# Altium schematic sheet S7CAS-PLEIADES-CARTE-MERE_P07_ADC.SchDoc
size Tabloid; DocumentNumber: 15; SheetNumber: 15; SheetTotal: 16; Sheet_Name: ADC; Size: 11x17
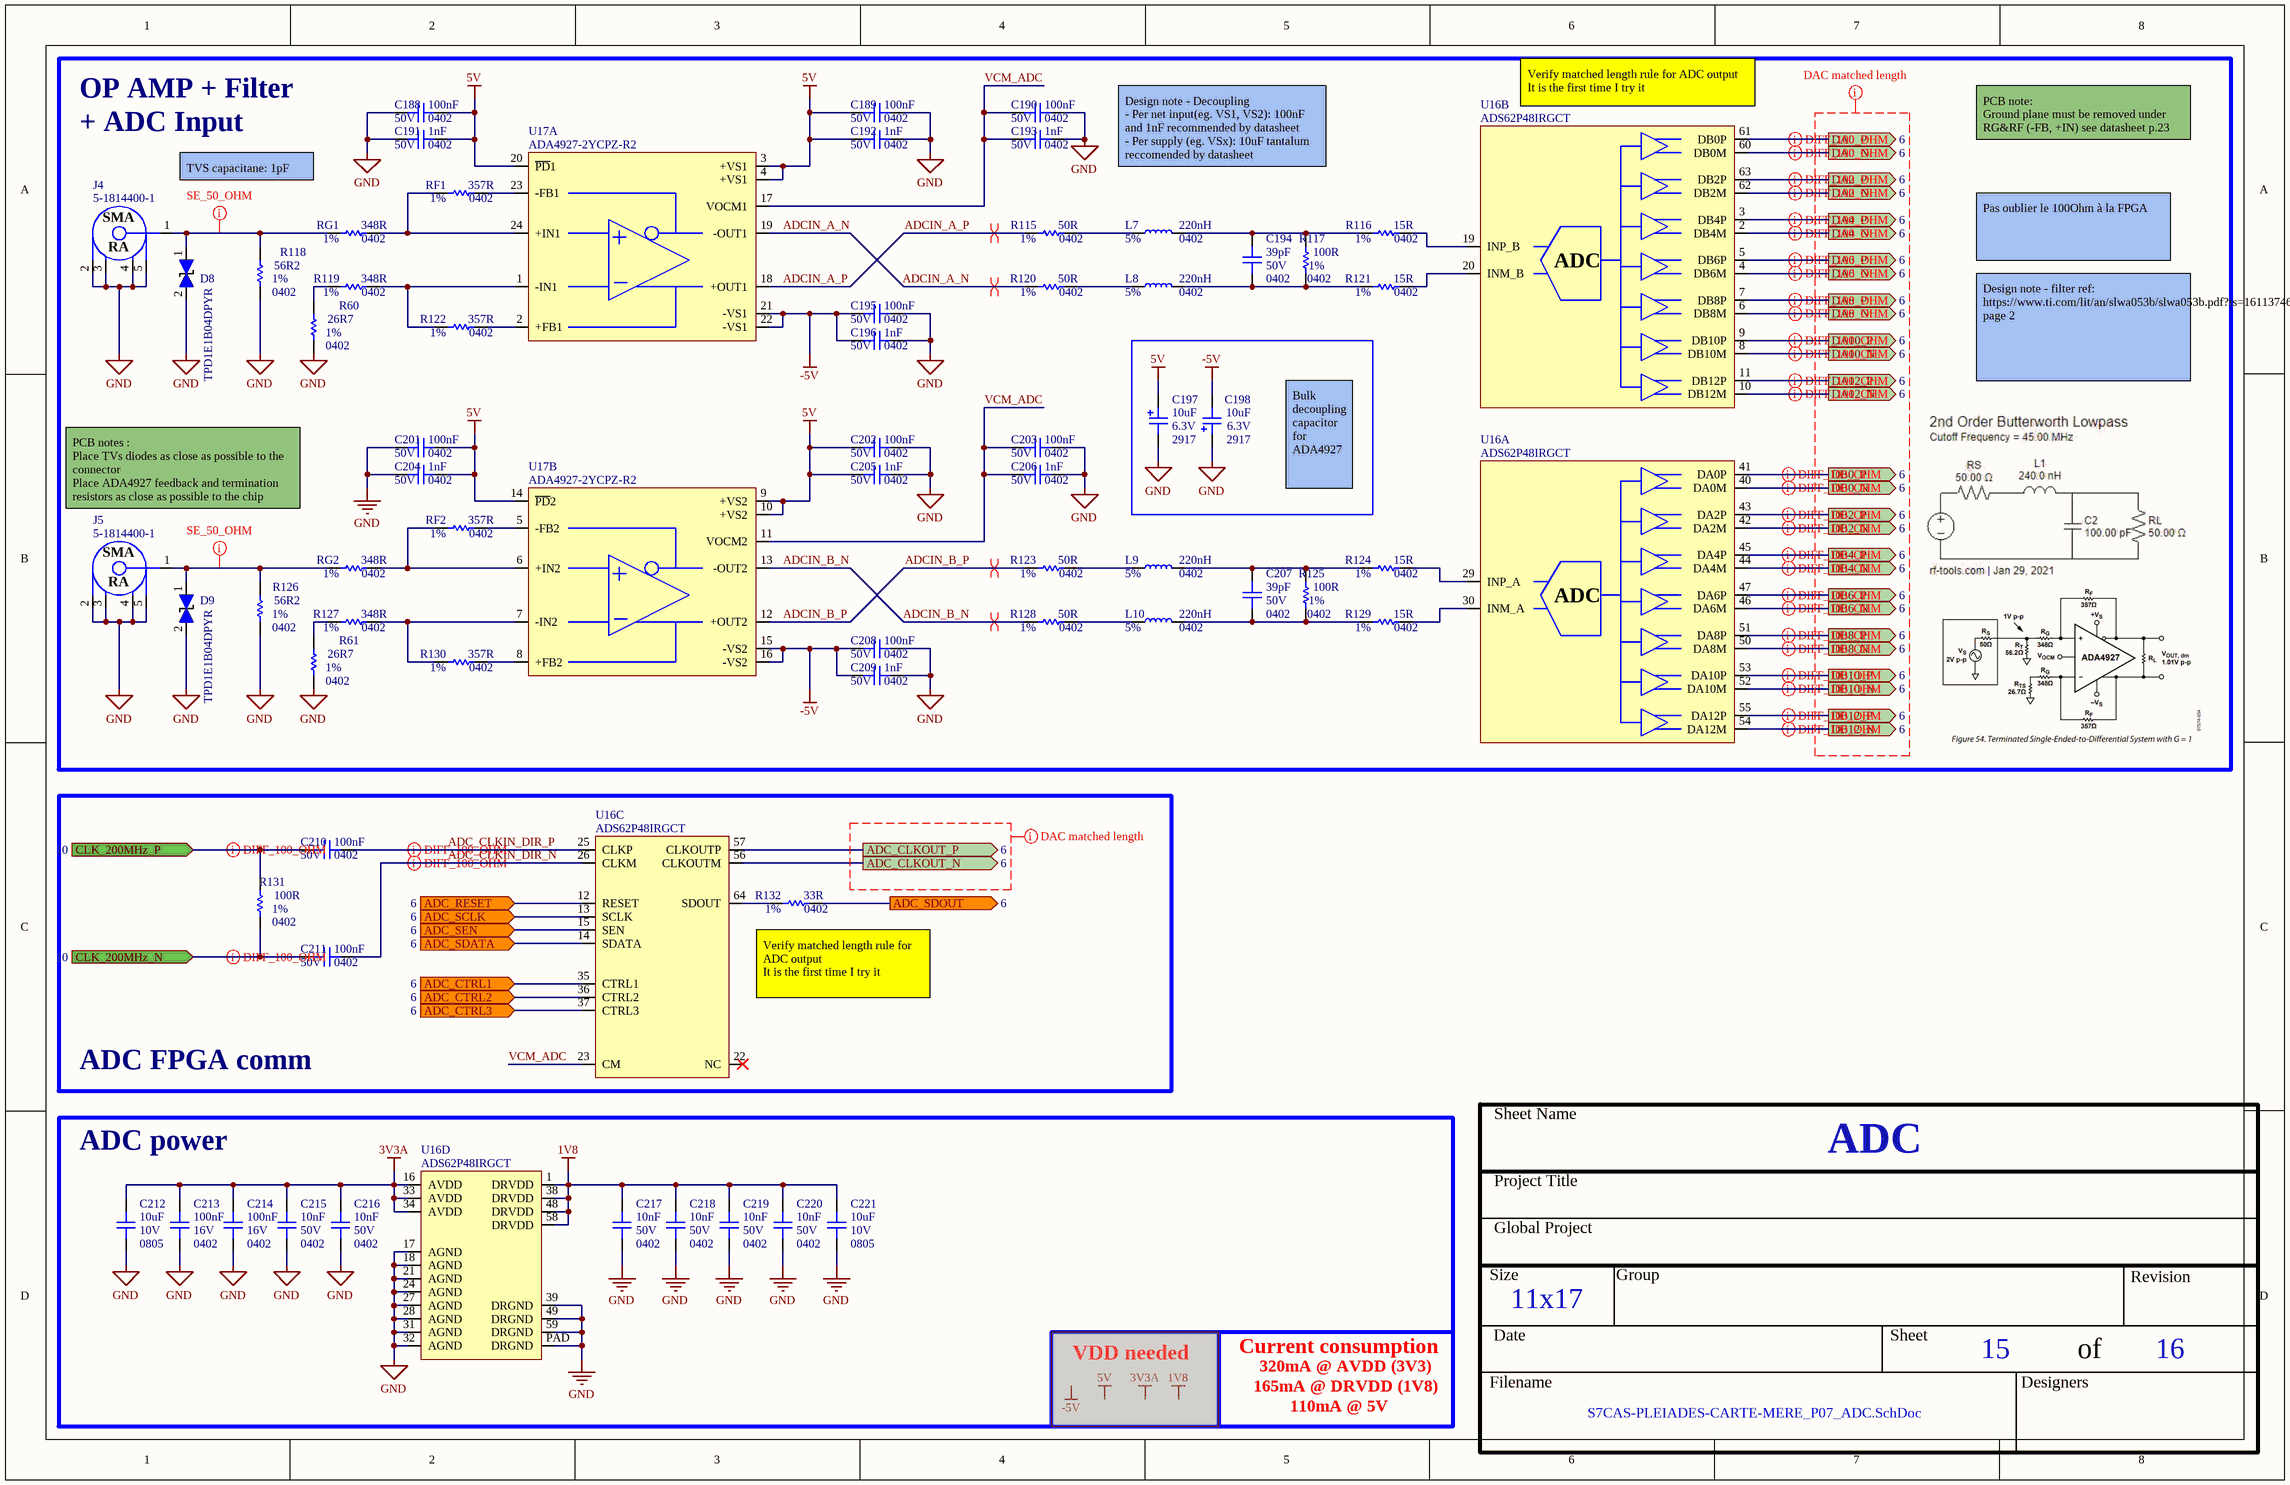
[diagram p0: S7CAS-PLEIADES-CARTE-MERE_P07_ADC.SchDoc]

## Parts
C188  value 100nF  Voltage: 50V  Package: 0402  [CAP_0402]  (hidden comment: CAP - 0402)
C189  value 100nF  Voltage: 50V  Package: 0402  [CAP_0402]  (hidden comment: CAP - 0402)
C190  value 100nF  Voltage: 50V  Package: 0402  [CAP_0402]  (hidden comment: CAP - 0402)
C191  value 1nF  Voltage: 50V  Package: 0402  [CAP_0402]  (hidden comment: CAP - 0402)
C192  value 1nF  Voltage: 50V  Package: 0402  [CAP_0402]  (hidden comment: CAP - 0402)
C193  value 1nF  Voltage: 50V  Package: 0402  [CAP_0402]  (hidden comment: CAP - 0402)
C194  value 39pF  Voltage: 50V  Package: 0402  [CAP_0402]  (hidden comment: CAP - 0402)
C195  value 100nF  Voltage: 50V  Package: 0402  [CAP_0402]  (hidden comment: CAP - 0402)
C196  value 1nF  Voltage: 50V  Package: 0402  [CAP_0402]  (hidden comment: CAP - 0402)
C197  value 10uF  Voltage: 6.3V  Package: 2917  [CAP_TAN_2917(D)]  (hidden comment: CAP - TANTALUM - CASE D)
C198  value 10uF  Voltage: 6.3V  Package: 2917  [CAP_TAN_2917(D)]  (hidden comment: CAP - TANTALUM - CASE D)
C201  value 100nF  Voltage: 50V  Package: 0402  [CAP_0402]  (hidden comment: CAP - 0402)
C202  value 100nF  Voltage: 50V  Package: 0402  [CAP_0402]  (hidden comment: CAP - 0402)
C203  value 100nF  Voltage: 50V  Package: 0402  [CAP_0402]  (hidden comment: CAP - 0402)
C204  value 1nF  Voltage: 50V  Package: 0402  [CAP_0402]  (hidden comment: CAP - 0402)
C205  value 1nF  Voltage: 50V  Package: 0402  [CAP_0402]  (hidden comment: CAP - 0402)
C206  value 1nF  Voltage: 50V  Package: 0402  [CAP_0402]  (hidden comment: CAP - 0402)
C207  value 39pF  Voltage: 50V  Package: 0402  [CAP_0402]  (hidden comment: CAP - 0402)
C208  value 100nF  Voltage: 50V  Package: 0402  [CAP_0402]  (hidden comment: CAP - 0402)
C209  value 1nF  Voltage: 50V  Package: 0402  [CAP_0402]  (hidden comment: CAP - 0402)
C210  value 100nF  Voltage: 50V  Package: 0402  [CAP_0402]  (hidden comment: CAP - 0402)
C211  value 100nF  Voltage: 50V  Package: 0402  [CAP_0402]  (hidden comment: CAP - 0402)
C212  value 10uF  Voltage: 10V  Package: 0805  [CAP_0805]  (hidden comment: CAP - 0805)
C213  value 100nF  Voltage: 16V  Package: 0402  [CAP_0402]  (hidden comment: CAP - 0402)
C214  value 100nF  Voltage: 16V  Package: 0402  [CAP_0402]  (hidden comment: CAP - 0402)
C215  value 10nF  Voltage: 50V  Package: 0402  [CAP_0402]  (hidden comment: CAP - 0402)
C216  value 10nF  Voltage: 50V  Package: 0402  [CAP_0402]  (hidden comment: CAP - 0402)
C217  value 10nF  Voltage: 50V  Package: 0402  [CAP_0402]  (hidden comment: CAP - 0402)
C218  value 10nF  Voltage: 50V  Package: 0402  [CAP_0402]  (hidden comment: CAP - 0402)
C219  value 10nF  Voltage: 50V  Package: 0402  [CAP_0402]  (hidden comment: CAP - 0402)
C220  value 10nF  Voltage: 50V  Package: 0402  [CAP_0402]  (hidden comment: CAP - 0402)
C221  value 10uF  Voltage: 10V  Package: 0805  [CAP_0805]  (hidden comment: CAP - 0805)
D8  TPD1E1B04DPYR  [TVS_DATA_TPD1E1B04DPYR]
D9  TPD1E1B04DPYR  [TVS_DATA_TPD1E1B04DPYR]
J4  5-1814400-1  [CONN_SMA_5-1814400-1]
J5  5-1814400-1  [CONN_SMA_5-1814400-1]
L7  value 220nH  Precision: 5%  Package: 0402  [IND_0402]  (hidden comment: IND_0402)
L8  value 220nH  Precision: 5%  Package: 0402  [IND_0402]  (hidden comment: IND_0402)
L9  value 220nH  Precision: 5%  Package: 0402  [IND_0402]  (hidden comment: IND_0402)
L10  value 220nH  Precision: 5%  Package: 0402  [IND_0402]  (hidden comment: IND_0402)
R60  value 26R7  Package: 0402  Precision: 1%  [RES_0402]  (hidden comment: RES - 0402)
R61  value 26R7  Package: 0402  Precision: 1%  [RES_0402]  (hidden comment: RES - 0402)
R115  value 50R  Package: 0402  Precision: 1%  [RES_0402]  (hidden comment: RES - 0402)
R116  value 15R  Package: 0402  Precision: 1%  [RES_0402]  (hidden comment: RES - 0402)
R117  value 100R  Package: 0402  Precision: 1%  [RES_0402]  (hidden comment: RES - 0402)
R118  value 56R2  Package: 0402  Precision: 1%  [RES_0402]  (hidden comment: RES - 0402)
R119  value 348R  Package: 0402  Precision: 1%  [RES_0402]  (hidden comment: RES - 0402)
R120  value 50R  Package: 0402  Precision: 1%  [RES_0402]  (hidden comment: RES - 0402)
R121  value 15R  Package: 0402  Precision: 1%  [RES_0402]  (hidden comment: RES - 0402)
R122  value 357R  Package: 0402  Precision: 1%  [RES_0402]  (hidden comment: RES - 0402)
R123  value 50R  Package: 0402  Precision: 1%  [RES_0402]  (hidden comment: RES - 0402)
R124  value 15R  Package: 0402  Precision: 1%  [RES_0402]  (hidden comment: RES - 0402)
R125  value 100R  Package: 0402  Precision: 1%  [RES_0402]  (hidden comment: RES - 0402)
R126  value 56R2  Package: 0402  Precision: 1%  [RES_0402]  (hidden comment: RES - 0402)
R127  value 348R  Package: 0402  Precision: 1%  [RES_0402]  (hidden comment: RES - 0402)
R128  value 50R  Package: 0402  Precision: 1%  [RES_0402]  (hidden comment: RES - 0402)
R129  value 15R  Package: 0402  Precision: 1%  [RES_0402]  (hidden comment: RES - 0402)
R130  value 357R  Package: 0402  Precision: 1%  [RES_0402]  (hidden comment: RES - 0402)
R131  value 100R  Package: 0402  Precision: 1%  [RES_0402]  (hidden comment: RES - 0402)
R132  value 33R  Package: 0402  Precision: 1%  [RES_0402]  (hidden comment: RES - 0402)
RF1  value 357R  Package: 0402  Precision: 1%  [RES_0402]  (hidden comment: RES - 0402)
RF2  value 357R  Package: 0402  Precision: 1%  [RES_0402]  (hidden comment: RES - 0402)
RG1  value 348R  Package: 0402  Precision: 1%  [RES_0402]  (hidden comment: RES - 0402)
RG2  value 348R  Package: 0402  Precision: 1%  [RES_0402]  (hidden comment: RES - 0402)
U16  ADS62P48IRGCT  [ADC_ADS62P48IRGCT]  (parts A,B,C,D of 4)
U17  ADA4927-2YCPZ-R2  [OPAMP_ADA4927-2YCPZ-R2]  (parts A,B of 2)

## Blocks framed on the sheet
ADC FPGA comm: C210 C211 R131 R132 U16
ADC power: C212-C221 U16

## Ports
ADC_CLKOUT_N (out, see 6), ADC_CLKOUT_P (out, see 6), ADC_CTRL1 (in, see 6), ADC_CTRL2 (in, see 6), ADC_CTRL3 (in, see 6), ADC_RESET (in, see 6), ADC_SCLK (in, see 6), ADC_SDATA (in, see 6), ADC_SDOUT (out, see 6), ADC_SEN (in, see 6), CLK_200MHz_N (in, see 10), CLK_200MHz_P (in, see 10), DA0_N (out, see 6), DA0_P (out, see 6), DA2_N (out, see 6), DA2_P (out, see 6), DA4_N (out, see 6), DA4_P (out, see 6), DA6_N (out, see 6), DA6_P (out, see 6), DA8_N (out, see 6), DA8_P (out, see 6), DA10_N (out, see 6), DA10_P (out, see 6), DA12_N (out, see 6), DA12_P (out, see 6), DB0_N (out, see 6), DB0_P (out, see 6), DB2_N (out, see 6), DB2_P (out, see 6), DB4_N (out, see 6), DB4_P (out, see 6), DB6_N (out, see 6), DB6_P (out, see 6), DB8_N (out, see 6), DB8_P (out, see 6), DB10_N (out, see 6), DB10_P (out, see 6), DB12_N (out, see 6), DB12_P (out, see 6)

## Nets
1V8: C217.2 C218.2 C219.2 C220.2 C221.2 U16.1(DRVDD) U16.38(DRVDD) U16.48(DRVDD) U16.58(DRVDD)
3V3A: C212.2 C213.2 C214.2 C215.2 C216.2 U16.16(AVDD) U16.33(AVDD) U16.34(AVDD)
5V: C188.1 C189.2 C191.1 C192.2 C197.1 C201.1 C202.2 C204.1 C205.2 U17.3(+VS1) U17.4(+VS1) U17.9(+VS2) U17.10(+VS2) U17.14(~{PD}2) U17.20(~{PD}1)
-5V: C195.2 C196.2 C198.2 C208.2 C209.2 U17.15(-VS2) U17.16(-VS2) U17.21(-VS1) U17.22(-VS1)
GND: C188.2 C189.1 C190.1 C191.2 C192.1 C193.1 C195.1 C196.1 C197.2 C198.1 C201.2 C202.1 C203.1 C204.2 C205.1 C206.1 C208.1 C209.1 C212.1 C213.1 C214.1 C215.1 C216.1 C217.1 C218.1 C219.1 C220.1 C221.1 D8.2(i/o) D9.2(i/o) J4.2 J4.3 J4.4 J4.5 J5.2 J5.3 J5.4 J5.5 R60.1 R61.1 R118.1 R126.1 U16.17(AGND) U16.18(AGND) U16.21(AGND) U16.24(AGND) U16.27(AGND) U16.28(AGND) U16.31(AGND) U16.32(AGND) U16.39(DRGND) U16.49(DRGND) U16.59(DRGND) U16.PAD(DRGND)
ADC_CLKIN_DIR_N: C211.1 U16.26(CLKM)
ADC_CLKIN_DIR_P: C210.1 U16.25(CLKP)
ADC_CLKOUT_N: U16.56(CLKOUTM) ; port ADC_CLKOUT_N
ADC_CLKOUT_P: U16.57(CLKOUTP) ; port ADC_CLKOUT_P
ADC_CTRL1: U16.35(CTRL1) ; port ADC_CTRL1
ADC_CTRL2: U16.36(CTRL2) ; port ADC_CTRL2
ADC_CTRL3: U16.37(CTRL3) ; port ADC_CTRL3
ADC_RESET: U16.12(RESET) ; port ADC_RESET
ADC_SCLK: U16.13(SCLK) ; port ADC_SCLK
ADC_SDATA: U16.14(SDATA) ; port ADC_SDATA
ADC_SDOUT: R132.1 ; port ADC_SDOUT
ADC_SEN: U16.15(SEN) ; port ADC_SEN
ADCIN_A_N: R120.2 U17.19(-OUT1)
ADCIN_A_P: R115.2 U17.18(+OUT1)
ADCIN_B_N: R128.2 U17.13(-OUT2)
ADCIN_B_P: R123.2 U17.12(+OUT2)
CLK_200MHz_N: C211.2 R131.1 ; port CLK_200MHz_N
CLK_200MHz_P: C210.2 R131.2 ; port CLK_200MHz_P
DA0_N: U16.60(DB0M) ; port DA0_N
DA0_P: U16.61(DB0P) ; port DA0_P
DA2_N: U16.62(DB2M) ; port DA2_N
DA2_P: U16.63(DB2P) ; port DA2_P
DA4_N: U16.2(DB4M) ; port DA4_N
DA4_P: U16.3(DB4P) ; port DA4_P
DA6_N: U16.4(DB6M) ; port DA6_N
DA6_P: U16.5(DB6P) ; port DA6_P
DA8_N: U16.6(DB8M) ; port DA8_N
DA8_P: U16.7(DB8P) ; port DA8_P
DA10_N: U16.8(DB10M) ; port DA10_N
DA10_P: U16.9(DB10P) ; port DA10_P
DA12_N: U16.10(DB12M) ; port DA12_N
DA12_P: U16.11(DB12P) ; port DA12_P
DB0_N: U16.40(DA0M) ; port DB0_N
DB0_P: U16.41(DA0P) ; port DB0_P
DB2_N: U16.42(DA2M) ; port DB2_N
DB2_P: U16.43(DA2P) ; port DB2_P
DB4_N: U16.44(DA4M) ; port DB4_N
DB4_P: U16.45(DA4P) ; port DB4_P
DB6_N: U16.46(DA6M) ; port DB6_N
DB6_P: U16.47(DA6P) ; port DB6_P
DB8_N: U16.50(DA8M) ; port DB8_N
DB8_P: U16.51(DA8P) ; port DB8_P
DB10_N: U16.52(DA10M) ; port DB10_N
DB10_P: U16.53(DA10P) ; port DB10_P
DB12_N: U16.54(DA12M) ; port DB12_N
DB12_P: U16.55(DA12P) ; port DB12_P
VCM_ADC: C190.2 C193.2 C203.2 C206.2 U16.23(CM) U17.11(VOCM2) U17.17(VOCM1)
NetC194_1: C194.1 L8.1 R117.1 R121.2
NetC194_2: C194.2 L7.1 R116.2 R117.2
NetC207_1: C207.1 L10.1 R125.1 R129.2
NetC207_2: C207.2 L9.1 R124.2 R125.2
NetD8_1: D8.1(i/o) J4.1 R118.2 RG1.2
NetD9_1: D9.1(i/o) J5.1 R126.2 RG2.2
NetL7_2: L7.2 R115.1
NetL8_2: L8.2 R120.1
NetL9_2: L9.2 R123.1
NetL10_2: L10.2 R128.1
NetR60_2: R60.2 R119.2
NetR61_2: R61.2 R127.2
NetR116_1: R116.1 U16.19(INP_B)
NetR119_1: R119.1 R122.2 U17.1(-IN1)
NetR121_1: R121.1 U16.20(INM_B)
NetR122_1: R122.1 U17.2(+FB1)
NetR124_1: R124.1 U16.29(INP_A)
NetR127_1: R127.1 R130.2 U17.7(-IN2)
NetR129_1: R129.1 U16.30(INM_A)
NetR130_1: R130.1 U17.8(+FB2)
NetR132_2: R132.2 U16.64(SDOUT)
NetRF1_1: RF1.1 U17.23(-FB1)
NetRF1_2: RF1.2 RG1.1 U17.24(+IN1)
NetRF2_1: RF2.1 U17.5(-FB2)
NetRF2_2: RF2.2 RG2.1 U17.6(+IN2)

Not connected (* = marked no-connect by the designer): U16 22(NC)*

## Layout directives
differential pair; net class DIFF_100_OHM: ADC_CLKIN_DIR_N, ADC_CLKIN_DIR_P, CLK_200MHz_N, CLK_200MHz_P
differential pair; differential pair class DIFF_100_OHM: DA0_N, DA0_P, DA2_N, DA2_P, DA4_N, DA4_P, DA6_N, DA6_P, DA8_N, DA8_P, DA10_N, DA10_P, DA12_N, DA12_P, DB0_N, DB0_P, DB2_N, DB2_P, DB4_N, DB4_P, DB6_N, DB6_P, DB8_N, DB8_P, DB10_N, DB10_P, DB12_N, DB12_P
rule Matched Net Lengths [Tolerance = 1mil]; net class DAC_OUT: (no net found under the mark)
mark named SE_50_OHM: NetD8_1, NetD9_1
differential pair: ADCIN_A_N, ADCIN_A_P, ADCIN_B_N, ADCIN_B_P

## Notes on the sheet
- OP AMP + Filter
- + ADC Input
- Design note - Decoupling
  - Per net input(eg. VS1, VS2): 100nF and 1nF recommended by datasheet
  - Per supply (eg. VSx): 10uF tantalum reccomended by datasheet
- (near U16) Verify matched length rule for ADC output
  It is the first time I try it
- PCB note:
  Ground plane must be removed under RG&RF (-FB, +IN) see datasheet p.23
- TVS capacitane: 1pF nom.
- Pas oublier le 100Ohm à la FPGA
- Design note - filter ref:
  https://www.ti.com/lit/an/slwa053b/slwa053b.pdf?ts=1611374664037&ref_url=https%253A%252F%252Fwww.google.com%252F
  page 2
- Bulk decoupling capacitor for ADA4927
- PCB notes :
  Place TVs diodes as close as possible to the connector
  Place ADA4927 feedback and termination resistors as close as possible to the chip
- Verify matched length rule for ADC output
  It is the first time I try it
- VDD needed
- Current consumption
- 320mA @ AVDD (3V3)
- 110mA @ 5V
- 165mA @ DRVDD (1V8)
- Sheet Name
- Project Title
- Global Project
- Size
- Group
- Revision
- Date
- Sheet
- of
- Filename
- Designers
- (in symbol ADC_ADS62P48IRGCT, part A) ADC
- (in symbol ADC_ADS62P48IRGCT, part B) ADC
- (in symbol CONN_SMA_5-1814400-1) SMA; RA

## Library data of the parts
C188-C196 C201-C211 = CAP - 0402: Precision: 10%; Current: *; CreatedBy: Jonathan Bouchard; Power: *
C197 C198 = CAP_TANT_2917(D): CAP - TANTALUM - 2917; Precision: 10%; Current: *; CreatedBy: Jonathan Bouchard; Power: *
C212 C221 = CAP - 0805: Mfg: CL21B106KPQNNNE; Precision: 10%; Current: *; CreatedBy: Jonathan Bouchard; Power: *
C213 C214 = CAP - 0402: Mfg Part Number: CL05B104KO5NNNC; Precision: 10%; Current: *; CreatedBy: Jonathan Bouchard; Power: *
C215-C220 = CAP - 0402: Mfg Part Number: CL05B103KB5NNNC; Precision: 10%; Current: *; CreatedBy: Jonathan Bouchard; Temperature: X7R; Power: *
D8 D9 = TVS_DATA_TPD1E1B04DPYR: TVS - TVS DIODE 3.6V 8.5V - 0402; Manufacturer #1: Texas Instruments; Current Rating: 6.3Apeak; Power Max: 50Wpeak; GRAMS Lib Spec: 2.8; Magnetic Material: Unknown; Polarized: No; Value: *; Tolerance: *; Voltage Rating: 3.6V; HelpURL: http://www.ti.com/lit/ds/symlink/tpd1e1b04.pdf; CreatedBy/Date: Keven Deslandes - 2018/10/19; VerifiedBy: Caroline Paulin - 28 janv 2019; Temperature: -40°C ~ 125°C (TA); Package: 0402; Manufacturer #2: *; Note: *; Assembly Type: SMD; Part Number #2: *; Part Number #1: TPD1E1B04DPYR; Supplier 1: Digi-Key; Supplier Part Number 1: 296-47364-1-ND; Cryo: UNKNOWN
J4 J5 = CONN_SMA_5-1814400-1: CONN -  SMA JACK R/A 50 OHM - TH; Mfg: TE Connectivity AMP Connectors; Voltage: *; Current: *; Power: *; Mfg Part Number: 5-1814400-1; HelpURL: http://www.te.com/commerce/DocumentDelivery/DDEController?Action=srchrtrv&DocNm=1814400&DocType=Customer+Drawing&DocLang=English; CreatedBy: Jonathan Bouchard; Temperature: -55°C ~ 85°C; Value: *; Precision: *; Package: TH-5; Supplier 1: Digikey; Supplier Part Number 1: A97593-ND
R60 R61 R115-R132 RF1 RF2 RG1 RG2 = RES - 0402: Voltage: 50V; Power: 1/16W; Current: *; CreatedBy: Jonathan Bouchard
U16 = ADC_ADS62P48IRGCT: ADC - 14 BIT 210MSPS SUAL - VQFN-64; Voltage: 3.15 V ~ 3.6 V / 1.7 V ~ 1.9 V; Mfg: Texas Instruments; Precision: 14 Bit; Current: *; Power: *; Mfg Part Number: ADS62P48IRGCT; HelpURL: http://www.ti.com/lit/ds/symlink/ads62p48.pdf; CreatedBy: Jonathan Bouchard; Temperature: -40°C ~ 85°C; Value: *; Package: VQFN-64; Supplier 1: Digikey; Supplier Part Number 1: 296-24611-1-ND
U17 = OPAMP_ADA4927-2YCPZ-R2: OPAMP - CFA 2.3GHZ - QFN-24; Voltage: 4.5 V ~ 11 V, ±2.25 V ~ 5.5 V; Current: 65mA; Mfg: Analog Devices; Power: *; Mfg Part Number: ADA4927-2YCPZ-R2; HelpURL: http://www.analog.com/media/en/technical-documentation/data-sheets/ADA4927-1_4927-2.pdf; CreatedBy: Jonathan Bouchard; Temperature: -40°C ~ 105°C; Value: *; Precision: *; Package: QFN-24; Supplier 1: Digikey; Supplier Part Number 1: ADA4927-2YCPZ-R2CT-ND
L7-L10 = IND_0402: Voltage: *; CreatedBy: Jonathan Bouchard; Power: *; NI: *; Current: *